# Altium schematic sheet Power.SchDoc
size A4; SheetNumber: 2; SheetTotal: 4
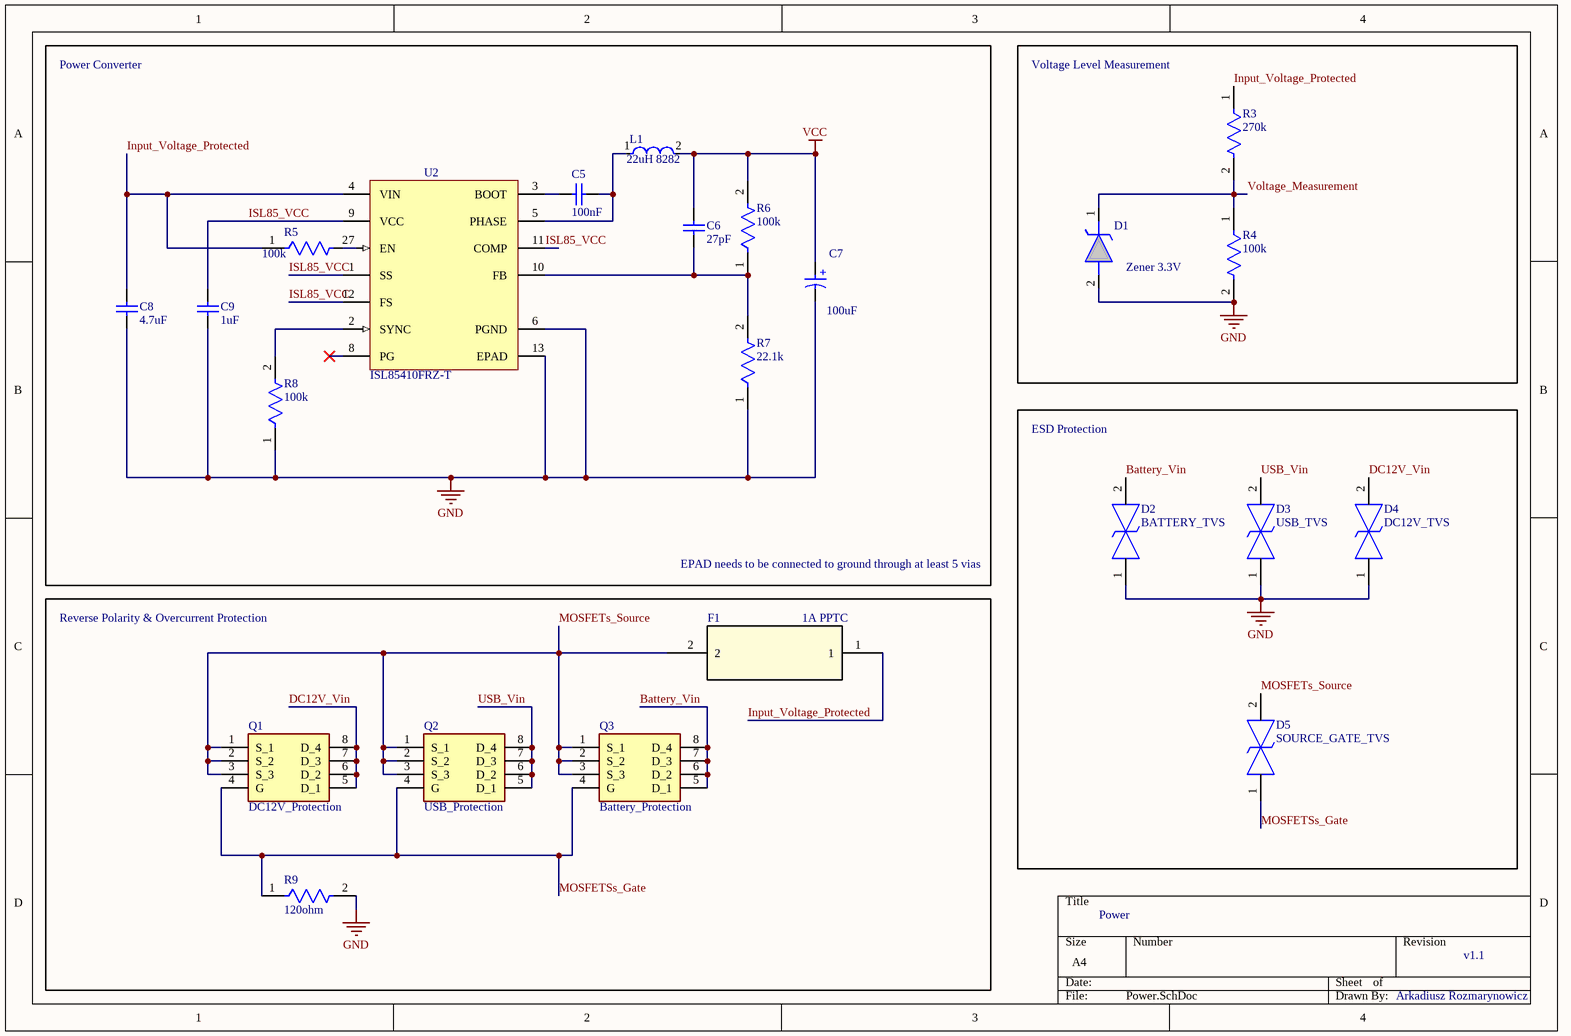
[diagram p0: Power.SchDoc]

## Parts
C5  100nF  [CAPC2013X145X48NL20T23]
C6  27pF  [CAPC2013X145X48NL20T23]
C7  100uF  [WCAP-ASLI_D6.3H7.7]
C8  4.7uF  [CAPC2013X145X48NL20T23]
C9  1uF  [CAPC2013X145X48NL20T23]
D1  Zener 3.3V  [ZMM33B]
D2  BATTERY_TVS  [DIONM5127X250N]
D3  USB_TVS  [DIONM5127X250N]
D4  DC12V_TVS  [DIONM5127X250N]
D5  SOURCE_GATE_TVS  [DIONM5127X250N]
F1  1A PPTC  [CHIP_ 0603L_1P8X1_LTF]
L1  22uH 8282  [FP-IHLP-3232DZ-FP_2_413x5-MFG]
Q1  DC12V_Protection  [SOIC127P600X170-8N]
Q2  USB_Protection  [SOIC127P600X170-8N]
Q3  Battery_Protection  [SOIC127P600X170-8N]
R3  270k  [FP-CRGCQ0805-IPC_C]
R4  100k  [FP-CRGCQ0805-IPC_C]
R5  100k  [FP-CRGCQ0805-IPC_C]
R6  100k  [FP-CRGCQ0805-IPC_C]
R7  22.1k  [FP-CRGCQ0805-IPC_C]
R8  100k  [FP-CRGCQ0805-IPC_C]
R9  120ohm  [FP-CRGCQ0805-IPC_C]
U2  ISL85410FRZ-T  [L12_4x3_MFG]

## Blocks framed on the sheet
Voltage Level Measurement: D1 R3 R4
ESD Protection: D2-D5
Reverse Polarity & Overcurrent Protection: F1 Q1-Q3 R9

## Nets
GND: C7.2(N) C8.1 C9.1 D1.2(A) D2.1 D3.1 D4.1 R4.2 R7.1 R8.1 R9.2 U2.6(PGND) U2.13(EPAD)
VCC: C6.2 C7.1(P) L1.2 R6.2
Battery_Vin: D2.2 Q3.5(D_1) Q3.6(D_2) Q3.7(D_3) Q3.8(D_4)
DC12V_Vin: D4.2 Q1.5(D_1) Q1.6(D_2) Q1.7(D_3) Q1.8(D_4)
Input_Voltage_Protected: C8.2 F1.1 R3.1 R5.1 U2.4(VIN)
ISL85_VCC: C9.2 U2.1(SS) U2.9(VCC) U2.11(COMP) U2.12(FS)
MOSFETs_Source: D5.2 F1.2 Q1.1(S_1) Q1.2(S_2) Q1.3(S_3) Q2.1(S_1) Q2.2(S_2) Q2.3(S_3) Q3.1(S_1) Q3.2(S_2) Q3.3(S_3)
MOSFETSs_Gate: D5.1 Q1.4(G) Q2.4(G) Q3.4(G) R9.1
USB_Vin: D3.2 Q2.5(D_1) Q2.6(D_2) Q2.7(D_3) Q2.8(D_4)
Voltage_Measurement: D1.1(K) R3.2 R4.1
NetC5_1: C5.1 L1.1 U2.5(PHASE)
NetC5_2: C5.2 U2.3(BOOT)
NetC6_1: C6.1 R6.1 R7.2 U2.10(FB)
NetR5_2: R5.2 U2.7(EN)
NetR8_2: R8.2 U2.2(SYNC)

Not connected (* = marked no-connect by the designer): U2 8(PG)*

## Notes on the sheet
- Power Converter
- EPAD needs to be connected to ground through at least 5 vias
- Power
- v1.1
- Arkadiusz Rozmarynowicz
- (in symbol CMP-03913-54202496-2) +

## Library data of the parts
C5 C6 C8 C9 = CMP-2007-01705-1: Part Number: VJ0805Y104KXAMR; Manufacturer: Vitramon
C7 = CMP-03913-54202496-2: Cap Aluminum Lytic 100uF 35V 20% (6.3 X 7.7mm) SMD 300mA 2000h 105C T/R; Capacitance: 100µF; Impedance: 380mΩ; Insulation Resistance: 1MΩ; ESR (Equivalent Series Resistance): 321.392mΩ; Dissipation Factor: 14%; Leakage Current: 35µA; Life (Hours): 2000hours; Min Operating Temperature: -55°C; Height: 7.7mm; Tolerance: 20%; Ripple Current (AC): 300mA; Length: 7.7mm; Width: 6.6mm; Voltage Rating: 35V; REACH SVHC: Unknown; Ripple Current: 300mA; Diameter: 6.3mm; Max Operating Temperature: 105°C; RoHS: Compliant; Voltage Rating (DC): 35V; Packaging: Cut Tape; Case/Package: Radial
D1 = ZMM33B: SMD Planra Zener Diode; Manufacturer_Name: Diotec; Geometry.Height: 1.45mm; Manufacturer_Part_Number: ZMM33B; Mouser Part Number: 637-ZMM33B; Mouser Price/Stock: https://www.mouser.co.uk/ProductDetail/Diotec-Semiconductor/ZMM33B?qs=OlC7AqGiEDlS5hTI7j6ASg%3D%3D; Arrow Part Number: ZMM33B; Arrow Price/Stock: https://www.arrow.com/en/products/zmm33b/diotec-semiconductor-ag?utm_currency=USD&region=nac; Datasheet Link: *
D2-D5 = SMAJ12CA-HP6AT_13: 19.9V Clamp 30.2A Ipp Tvs Diode Surface Mount DO-214AC (SMA); Manufacturer_Name: YAGEO; Manufacturer_Part_Number: SMAJ12CA-HP6AT/13; Geometry.Height: 2.5mm; Mouser Part Number: *; Mouser Price/Stock: *; Arrow Part Number: *; Arrow Price/Stock: *; Datasheet Link: https://www.yageo.com/upload/media/product/productsearch/datasheet/cpc/tvs/SMAJ-HP6AT_1.pdf
F1 = 0603L100SLYR: PPTC; Manufacturer_Name: Littelfuse Inc; Copyright: Copyright (C) 2025 Ultra Librarian. All rights reserved.; Manufacturer_Part_Number: 0603L100SLYR; RefDes: RefDes; Type: Type
L1 = CMP-02424-000385-1: Commercial Inductors, High Temperature (155 °C) Series 22uH 3.7A 110.21mΩ 20%; Max DC Current: 3.8A; DC Resistance (DCR): 110.21mR; Self Resonant Frequency: 9MHz; Test Frequency: 100kHz; Shielding: Shielded; Length: 0.322inch; Inductance: 22uH; Package Quantity: 500; Military Standard: Not; Min Operating Temperature: -55°C; Lead Free: Lead Free; Packaging: Tape and Reel; Current Rating: 3.7A; Depth: 8.26mm; Height: 4mm; Max Operating Temperature: 155°C; Width: 0.322inch; Tolerance: 20%; Case/Package: 3232; Saturation Current: 3.8A; Height - Seated (Max): 0.158inch; Mount: Surface Mount; Termination: SMD/SMT
Q1-Q3 = DMP3056LSS-13: MOSFET P Channel 30V 7.1A 2.1V @ 250uA 45m @ 6A,10V SOP-8_150mil RoHS; Manufacturer_Name: Diodes Incorporated; Geometry.Height: 1.7mm; Manufacturer_Part_Number: DMP3056LSS-13; Mouser Part Number: 621-DMP3056LSS-13; Mouser Price/Stock: https://www.mouser.co.uk/ProductDetail/Diodes-Incorporated/DMP3056LSS-13?qs=oUsD4qhOtFyEnPLZKitYRA%3D%3D; Arrow Part Number: DMP3056LSS-13; Arrow Price/Stock: https://www.arrow.com/en/products/dmp3056lss-13/diodes-incorporated?region=asia; Datasheet Link: https://www.diodes.com//assets/Datasheets/ds31421.pdf
R3 R4 R9 = CMP-03211-009742-1: CRGCQ0805 10KΩ 0.125W ±100ppm/°C 5% 150V; Manufacturer Part Number: CRGCQ0805J100K; Manufacturer: TE Connectivity; Resistance: 100ohm; Tolerance: 0.05; Value: 100ohm; Temperature Range High: +155°C; Automotive Grade: Grade 1142; RoHS: TRUE; Package: CRGCQ0805; Octopart: https://octopart.com/crgcq0805j100k-te+connectivity-91018199; Device Class L1: Passive Components; Lead Free: Yes; Temperature: -55°C to +155°C; Category: Res; ComponentLink2Description: Datasheet; Power Rating: 0.125W; Ambient Temperature Range High: +70°C; Composition: Thick Film; Temperature Range Low: -55°C; Voltage Rating: 150V; Device Class L3: Chip SMD Resistors; Height: 0.65mm; Series: CRGCQ; Temperature Coefficient: ±100ppm/°C; Automotive: Yes; Device Class L2: Resistors; Ipc Land Pattern Name: RESC200125X55; ComponentLink2URL: https://www.te.com/commerce/DocumentDelivery/DDEController?Action=showdoc&DocId=Data+Sheet%7F1773204-3%7F1%7Fpdf%7FEnglish%7FENG_DS_1773204-3_1.pdf%7F4-2176341-1151
R5-R8 = CMP-03211-009742-1: CRGCQ0805 100KΩ 0.125W ±100ppm/°C 5% 150V; Manufacturer Part Number: CRGCQ0805J100K; Manufacturer: TE Connectivity; Tolerance: 0.05; Temperature Range High: +155°C; Automotive Grade: Grade 1142; RoHS: TRUE; Package: CRGCQ0805; Octopart: https://octopart.com/crgcq0805j100k-te+connectivity-91018199; Device Class L1: Passive Components; Lead Free: Yes; Temperature: -55°C to +155°C; Category: Res; ComponentLink2Description: Datasheet; Power Rating: 0.125W; Ambient Temperature Range High: +70°C; Composition: Thick Film; Temperature Range Low: -55°C; Voltage Rating: 150V; Device Class L3: Chip SMD Resistors; Height: 0.65mm; Series: CRGCQ; Temperature Coefficient: ±100ppm/°C; Automotive: Yes; Device Class L2: Resistors; Ipc Land Pattern Name: RESC200125X55; ComponentLink2URL: https://www.te.com/commerce/DocumentDelivery/DDEController?Action=showdoc&DocId=Data+Sheet%7F1773204-3%7F1%7Fpdf%7FEnglish%7FENG_DS_1773204-3_1.pdf%7F4-2176341-1151
  R5 R6 R8: Resistance: 100KΩ; Value: 100KΩ
  R7: Resistance: 22.1k; Value: 22.1k
U2 = CMP-00572-88255842-3: Inverter RoHS Compliant Adjustable Positive Switching Regulator IC 125C 2MHz 1A 82.298666mg; Manufacturer Lifecycle Status: ACTIVE; Efficiency: 94%; RAM Size: 12kB; Max Supply Voltage: 40V; Topology: Buck; Min Output Voltage: 600mV; Max Junction Temperature (Tj): 125°C; Min Supply Voltage: 3V; Pitch: 500µm; Operating Supply Current: 4µA; Sync/Async: Synchronous; Max Output Voltage: 34V; Number of Outputs: 1; Synchronous Rectifier: Yes; Operating Supply Voltage: 36V; Quiescent Current: 80µA; HelpURL: https://octopart.com/cad-content/api/get-model-datasheet/15189/88255842; ComponentLink1URL: http://www.renesas.com; Switching Frequency: 2MHz; ComponentLink3URL: https://www.renesas.com/en/document/psc/l124x3-12-lead-dual-flat-no-lead-plastic-package?r=568491; Max Operating Temperature: 125°C; Export Control Classification Number (ECCN) Code: EAR99; Lead Free: Lead Free; ComponentLink2Description: Datasheet URL; Length: 4mm; Min Operating Temperature: -40°C; ComponentLink2URL: https://octopart.com/cad-content/api/get-model-datasheet/15189/88255842; ComponentLink1Description: Manufacturer's Website; Width: 3mm; Output Type: Adjustable; Max Output Current: 1A; Packaging: Tape & Reel; Case/Package: DFN; Mount: Surface Mount; Number of Pins: 12; Weight: 82.298666mg; Min Input Voltage: 3V; ComponentLink3Description: Manufacturer's Package Drawing; Max Input Voltage: 40V; Logic Function: Inverter; RoHS: Compliant; Output Current: 1A; Output Configuration: Positive; Lifecycle Status: Production; Height: 900µm; Output Voltage: 34V; Radiation Hardening: No